# Altium schematic sheet prelab8.SchDoc
size A
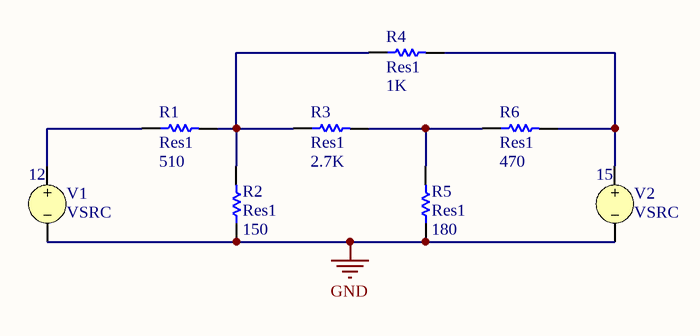
[diagram p0: prelab8.SchDoc]

## Parts
R1  Res1  value 510  [AXIAL-0.3]
R2  Res1  value 150  [AXIAL-0.3]
R3  Res1  value 2.7K  [AXIAL-0.3]
R4  Res1  value 1K  [AXIAL-0.3]
R5  Res1  value 180  [AXIAL-0.3]
R6  Res1  value 470  [AXIAL-0.3]
V1  VSRC  value 12
V2  VSRC  value 15

## Nets
GND: R2.1 R5.1 V1.2 V2.2
NetR1_1: R1.1 V1.1
NetR1_2: R1.2 R2.2 R3.1 R4.1
NetR3_2: R3.2 R5.2 R6.1
NetR4_2: R4.2 R6.2 V2.1

## Library data of the parts
R1-R6 = Res1: Resistor; Published: 8-Jun-2000; LatestRevisionDate: 17-Jul-2002; LatestRevisionNote: Re-released for DXP Platform.; PackageReference: AXIAL-0.3; Publisher: Altium Limited; PackageDescription: Axial Device, Thru-Hole; 2 Leads; 0.3 in Pin Spacing
V1 V2 = VSRC: Voltage Source; Note: PCB Footprint - Not required; Published: 8-Jun-2000; LatestRevisionDate: 17-Jul-2002; LatestRevisionNote: Re-released for DXP Platform.; PackageReference: Not Applicable; Publisher: Altium Limited